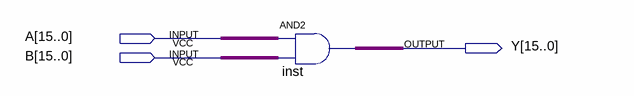
[diagram p0: schematic sheet]
// Quartus schematic AND2_16Bit.bdf as structural Verilog: 1 symbols, 3 pins
module AND2_16Bit (
  input  [15:0] A,
  input  [15:0] B,
  output [15:0] Y
);

  assign Y = A & B;  // AND2 inst, 16 bits wide
endmodule
